# EAGLE design Qwiic_Quad_Relay (EAGLE 9.6.2)
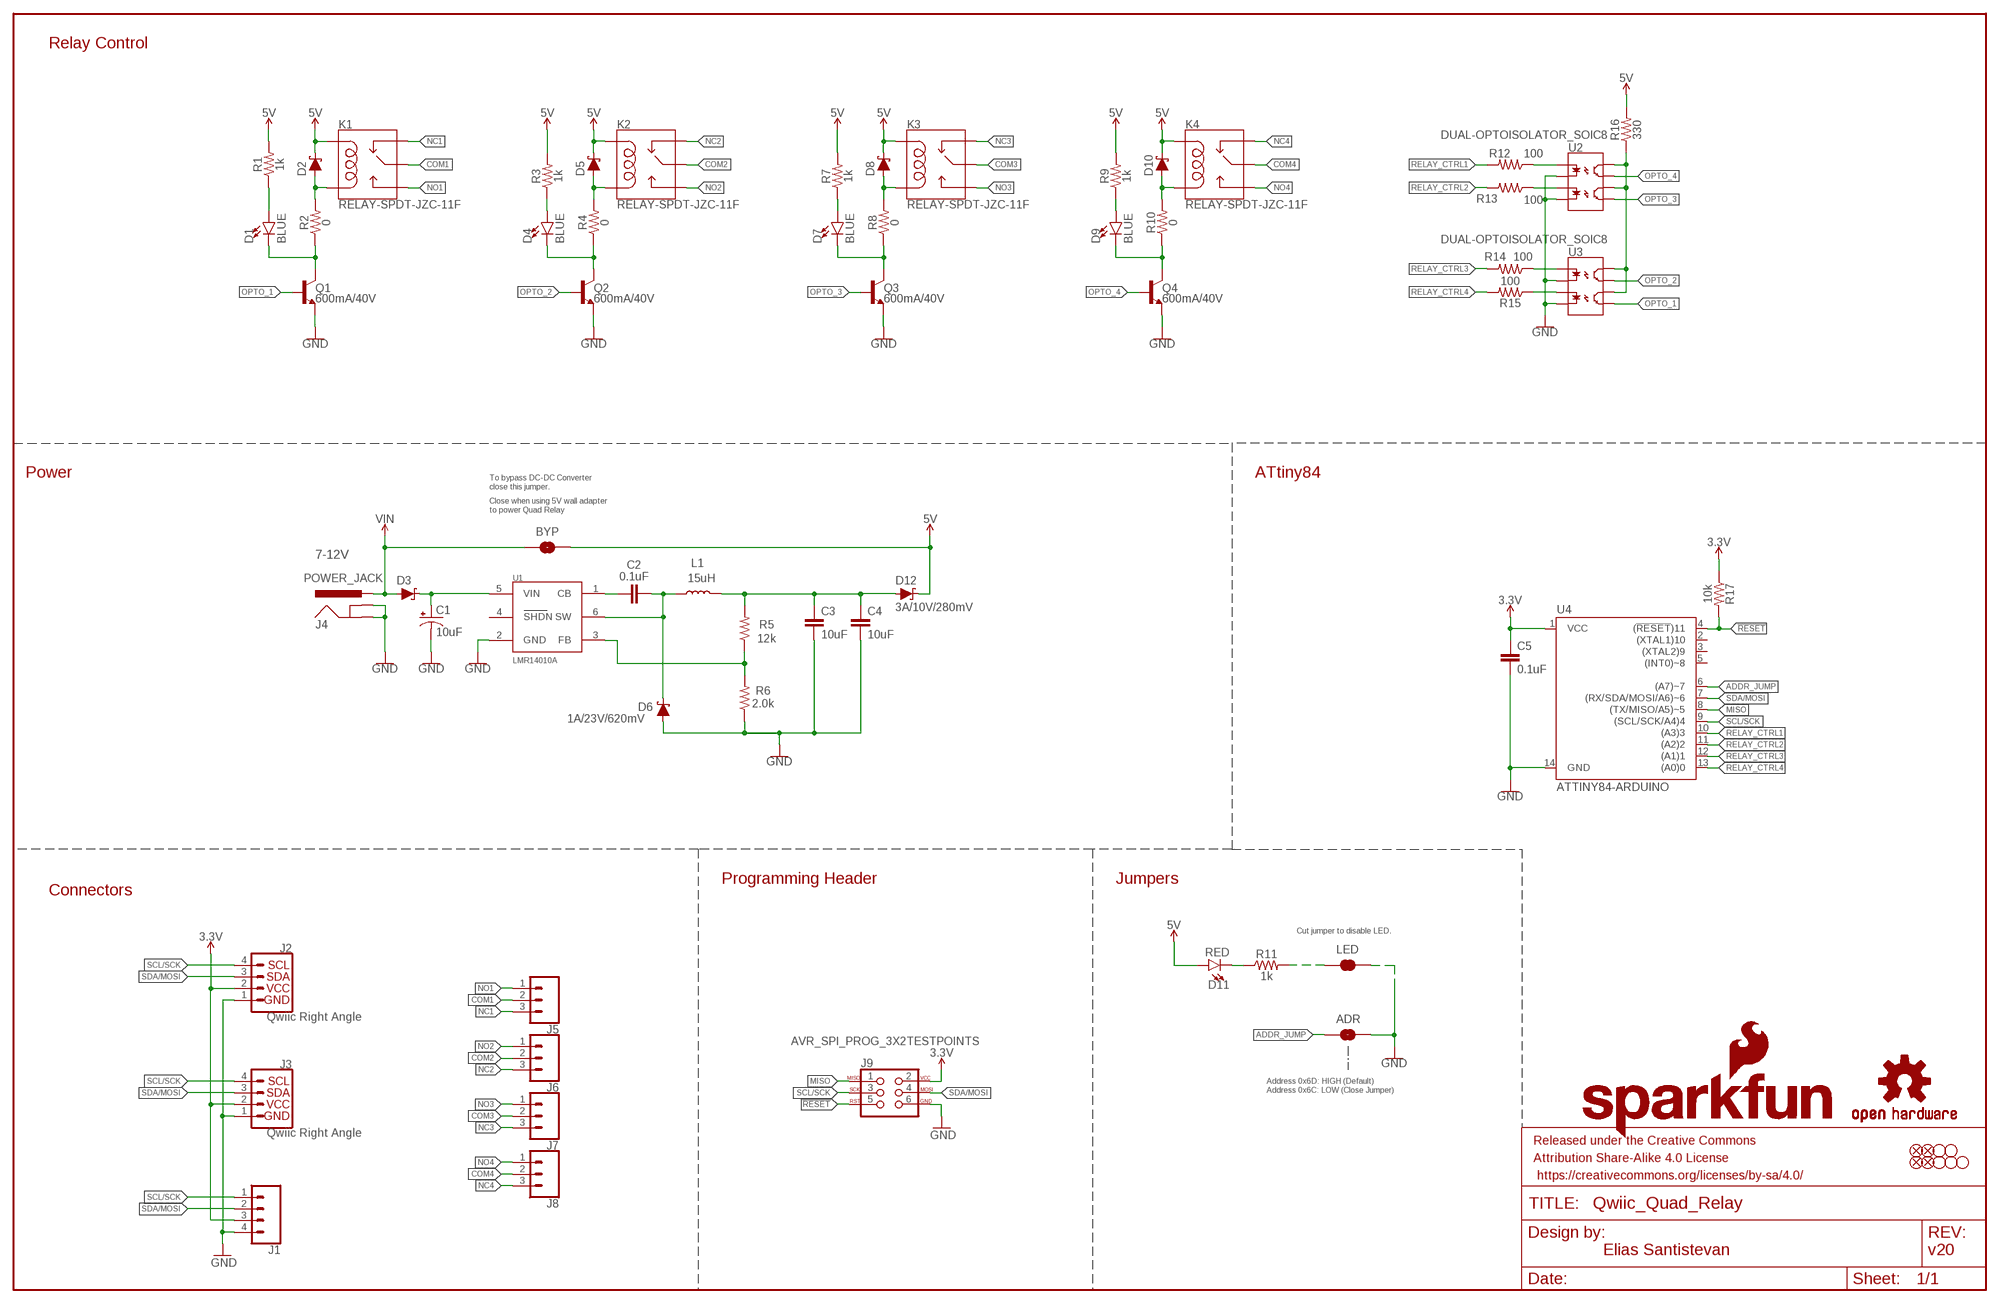
[diagram p0: schematic, sheet 1]

## Parts
ADR  JUMPER-SMT_2_NO_SILK  [SMT-JUMPER_2_NO_SILK]
BYP  JUMPER-SMT_2_NO_SILK  [SMT-JUMPER_2_NO_SILK]
C1  10uF  10UF-POLAR-EIA3528-20V-10%(TANT)  [EIA3528]
C2  0.1uF  0.1UF-0402-10V-10%-X7R  [0402]
C3  10uF  10UF-0603-6.3V-20%  [0603]
C4  10uF  10UF-0603-6.3V-20%  [0603]
C5  0.1uF  0.1UF-0603-25V-(+80/-20%)  [0603]
D1  BLUE  LED-BLUE0603  [LED-0603]
D2  1A/23V/620mV  DIODE-SCHOTTKY-BAT20J  [SOD-323]
D3  1A/40V/500mV  DIODE-SCHOTTKY-SS14  [SMA-DIODE]
D4  BLUE  LED-BLUE0603  [LED-0603]
D5  1A/23V/620mV  DIODE-SCHOTTKY-BAT20J  [SOD-323]
D6  1A/23V/620mV  DIODE-SCHOTTKY-BAT20J  [SOD-323]
D7  BLUE  LED-BLUE0603  [LED-0603]
D8  1A/23V/620mV  DIODE-SCHOTTKY-BAT20J  [SOD-323]
D9  BLUE  LED-BLUE0603  [LED-0603]
D10  1A/23V/620mV  DIODE-SCHOTTKY-BAT20J  [SOD-323]
D11  RED  LED-RED0603  [LED-0603]
D12  3A/10V/280mV  DIODE-SCHOTTKY-BAT60A  [SOD-323]
FD1  FIDUCIAL1X2  [FIDUCIAL-1X2]
FD2  FIDUCIAL1X2  [FIDUCIAL-1X2]
FD3  FIDUCIAL1X2  [FIDUCIAL-1X2]
FD4  FIDUCIAL1X2  [FIDUCIAL-1X2]
FRAME1  FRAME-LEDGER  [CREATIVE_COMMONS]
J1  CONN_041X04_NO_SILK_NO_POP  [1X04_NO_SILK]
J2  Qwiic Right Angle  I2C_STANDARDQWIIC  [JST04_1MM_RA]
J3  Qwiic Right Angle  I2C_STANDARDQWIIC  [JST04_1MM_RA]
J4  POWER_JACK  [POWER_JACK_PTH]
J5  CONN_03-SCREW-5MM  [SCREWTERMINAL-5MM-3]
J6  CONN_03-SCREW-5MM  [SCREWTERMINAL-5MM-3]
J7  CONN_03-SCREW-5MM  [SCREWTERMINAL-5MM-3]
J8  CONN_03-SCREW-5MM  [SCREWTERMINAL-5MM-3]
J9  AVR_SPI_PROG_3X2TESTPOINTS  [2X3_TEST_POINTS]
JP1  STAND-OFF  [STAND-OFF]
JP4  STAND-OFF  [STAND-OFF]
JP5  STAND-OFF  [STAND-OFF]
JP6  STAND-OFF  [STAND-OFF]
JP7  STAND-OFF  [STAND-OFF]
K1  RELAY-SPDT-JZC-11F  [RELAY-JZC]
K2  RELAY-SPDT-JZC-11F  [RELAY-JZC]
K3  RELAY-SPDT-JZC-11F  [RELAY-JZC]
K4  RELAY-SPDT-JZC-11F  [RELAY-JZC]
L1  15uH  INDUCTOR-LQH5B-15UH  [INDUCTOR_15UH]
LED  JUMPER-SMT_2_NC_TRACE_SILK  [SMT-JUMPER_2_NC_TRACE_SILK]
LOGO1  SFE_LOGO_NAME_FLAME.1_INCH  [SFE_LOGO_NAME_FLAME_.1]
LOGO2  OSHW-LOGOS  [OSHW-LOGO-S]
Q1  600mA/40V  TRANS_NPN-MMBT2222AL  [SOT23-3]
Q2  600mA/40V  TRANS_NPN-MMBT2222AL  [SOT23-3]
Q3  600mA/40V  TRANS_NPN-MMBT2222AL  [SOT23-3]
Q4  600mA/40V  TRANS_NPN-MMBT2222AL  [SOT23-3]
R1  1k  1KOHM-0603-1/10W-1%  [0603]
R2  0  0OHM-0603-1/10W  [0603]
R3  1k  1KOHM-0603-1/10W-1%  [0603]
R4  0  0OHM-0603-1/10W  [0603]
R5  12k  12KOHM-0603-1/10W-1%  [0603]
R6  2.0k  2.0KOHM-0603-1/10W-5%  [0603]
R7  1k  1KOHM-0603-1/10W-1%  [0603]
R8  0  0OHM-0603-1/10W  [0603]
R9  1k  1KOHM-0603-1/10W-1%  [0603]
R10  0  0OHM-0603-1/10W  [0603]
R11  1k  1KOHM-0603-1/10W-1%  [0603]
R12  100  100OHM-0603-1/10W-1%  [0603]
R13  100  100OHM-0603-1/10W-1%  [0603]
R14  100  100OHM-0603-1/10W-1%  [0603]
R15  100  100OHM-0603-1/10W-1%  [0603]
R16  330  330OHM-0603-1/10W-1%  [0603]
R17  10k  10KOHM-0603-1/10W-1%  [0603]
U1  LMR14010A  [SOT23-6]
U2  DUAL-OPTOISOLATOR_SOIC8  [SO08]
U3  DUAL-OPTOISOLATOR_SOIC8  [SO08]
U4  ATTINY84-ARDUINO  [SO14]

## Nets
3.3V: C5.1 J1.3 J2.2 J3.2 J9.2 R17.1 U4.1(VCC)
5V: BYP.2 D2.C D5.C D8.C D10.C D11.A D12.C K1.5(COIL1) K2.5(COIL1) K3.5(COIL1) K4.5(COIL1) R1.2 R3.2 R7.2 R9.2 R16.2
5V_OUT: C3.1 C4.1 D12.A L1.P2 R5.2
!RESET: J9.5 R17.2 U4.4((!RESET!)11)
ADDR_JUMP: ADR.1 U4.6((A7)~7)
CB: C2.1 U1.1(CB)
COM1: J5.2 K1.4(MAIN)
COM2: J6.2 K2.4(MAIN)
COM3: J7.2 K3.4(MAIN)
COM4: J8.2 K4.4(MAIN)
FB: R5.1 R6.2 U1.3(FB)
GND: ADR.2 C1.C(-) C3.2 C4.2 C5.2 D6.A J1.4 J2.1 J3.1 J4.GND J4.GNDBREAK J9.6 LED.1 Q1.2(E) Q2.2(E) Q3.2(E) Q4.2(E) R6.1 U1.2(GND) U2.2(C1) U2.4(C2) U3.2(C1) U3.4(C2) U4.14(GND)
MISO: J9.1 U4.8((TX/MISO/A5)~5)
N$1: D1.A R1.1
N$2: D1.C Q1.3(C) R2.1
N$3: R15.1 U3.3(A2)
N$4: D4.A R3.1
N$5: R14.1 U3.1(A1)
N$6: R16.1 U2.6(CL2) U2.8(CL1) U3.6(CL2) U3.8(CL1)
N$7: D7.A R7.1
N$8: D9.A R9.1
N$9: R12.1 U2.1(A1)
N$10: D2.A K1.1(COIL2) R2.2
N$11: R13.1 U2.3(A2)
N$12: D4.C Q2.3(C) R4.1
N$13: D11.C R11.1
N$14: LED.2 R11.2
N$15: D7.C Q3.3(C) R8.1
N$17: D9.C Q4.3(C) R10.1
N$18: D5.A K2.1(COIL2) R4.2
N$23: D8.A K3.1(COIL2) R8.2
N$24: D10.A K4.1(COIL2) R10.2
NC1: J5.3 K1.2(NC)
NC2: J6.3 K2.2(NC)
NC3: J7.3 K3.2(NC)
NC4: J8.3 K4.2(NC)
NO1: J5.1 K1.3(NO)
NO2: J6.1 K2.3(NO)
NO3: J7.1 K3.3(NO)
NO4: J8.1 K4.3(NO)
OPTO_1: Q1.1(B) U3.5(EM2)
OPTO_2: Q2.1(B) U3.7(EM1)
OPTO_3: Q3.1(B) U2.5(EM2)
OPTO_4: Q4.1(B) U2.7(EM1)
RELAY_CTRL1: R12.2 U4.10((A3)3)
RELAY_CTRL2: R13.2 U4.11((A2)2)
RELAY_CTRL3: R14.2 U4.12((A1)1)
RELAY_CTRL4: R15.2 U4.13((A0)0)
SCL/SCK: J1.1 J2.4 J3.4 J9.3 U4.9((SCL/SCK/A4)4)
SDA/MOSI: J1.2 J2.3 J3.3 J9.4 U4.7((RX/SDA/MOSI/A6)~6)
SW: C2.2 D6.C L1.P1 U1.6(SW)
VIN: BYP.1 D3.A J4.PWR
VIN_DC_DC: C1.A(+) D3.C U1.5(VIN)
Unconnected: U1.4(SHDN) U4.2((XTAL1)10) U4.3((XTAL2)9) U4.5((INT0)~8)

## Notes on the sheet
- Relay Control
- Power | ATtiny84
- To bypass DC-DC Converter
  close this jumper.
- Close when using 5V wall adapter
  to power Quad Relay
- 7-12V
- Programming Header | Jumpers
- Connectors
- Cut jumper to disable LED.
- Address 0x6D: HIGH (Default)
  Address 0x6C: LOW (Close Jumper)
- Elias Santistevan | v20

## Library data of the parts
ADR BYP = SparkFun-Jumpers:JUMPER-SMT_2_NO: Normally open jumper This jumper has two pads in close proximity to each other. Apply solder to close the connection. Round pads are easier to solder for beginners, but are a lot larger. SparkFun Product that uses the round pads: SparkFun EL Sequencer <https://www.sparkfun.com/products/12781>
C1 = SparkFun-Capacitors:10UF-POLAR: 10.0µF polarized capacitors A capacitor is a passive two-terminal electrical component used to store electrical energy temporarily in an electric field.; PROD_ID: CAP-08063
C2 = SparkFun-Capacitors:0.1UF: 0.1µF ceramic capacitors A capacitor is a passive two-terminal electrical component used to store electrical energy temporarily in an electric field.; PROD_ID: CAP-15083
C3 C4 = SparkFun-Capacitors:10UF: 10.0µF ceramic capacitors A capacitor is a passive two-terminal electrical component used to store electrical energy temporarily in an electric field.; PROD_ID: CAP-11015
C5 = SparkFun-Capacitors:0.1UF: 0.1µF ceramic capacitors A capacitor is a passive two-terminal electrical component used to store electrical energy temporarily in an electric field.; PROD_ID: CAP-00810
D1 D4 D7 D9 = SparkFun-LED:LED-BLUE: Blue SMD LED Used in manufacturing of various products at SparkFun Packages: 0603 - SMD 0603 package [Product Link] <http://www.digikey.com/product-detail/en/SMLE12BC7TT86/511-1589-2-ND/1641808> 1206 - SMD1206 package [Product Link] <http://www.digikey.com/product-detail/en/lite-on-inc/LTST-C150TBKT/160-1643-1-ND/573584> SparkFun Products: ESP8266 Thing-Dev Board <https://www.sparkfun.com/products/13711> RedBoard <https://www.sparkfun.com/products/12757>; PROD_ID: DIO-08575
D2 D5 D6 D8 D10 = SparkFun-DiscreteSemi:DIODE-SCHOTTKY: Schottky diode A Schottky diode is a semiconductor diode which has a low forward voltage drop and a very fast switching action.; PROD_ID: DIO-11623
D3 = SparkFun-DiscreteSemi:DIODE-SCHOTTKY: Schottky diode A Schottky diode is a semiconductor diode which has a low forward voltage drop and a very fast switching action.; PROD_ID: DIO-08053
D11 = SparkFun-LED:LED-RED: Red SMD LED Used in manufacturing of most products at SparkFun Packages: 0603 - SMD 0603 package [Product Link] <http://docs.avagotech.com/docs/AV02-0551EN> 0603 SMART - SMD 0603 SMART package ( more efficient and expensive)[Product Link] <http://www.osram-os.com/Graphics/XPic2/00077099_0.pdf> 1206 - SMD1206 package [Product Link] <https://www.sparkfun.com/datasheets/DevTools/LilyPad/Q150OVS4.pdff> SparkFun Products: Pro Mini 328 -5V <https://www.sparkfun.com/products/821> RedBoard <https://www.sparkfun.com/products/12757> IOIO-OTG <https://www.sparkfun.com/products/13613>; PROD_ID: DIO-00819
D12 = SparkFun-DiscreteSemi:DIODE-SCHOTTKY: Schottky diode A Schottky diode is a semiconductor diode which has a low forward voltage drop and a very fast switching action.; PROD_ID: DIO-14072
FD1-FD4 = SparkFun-Aesthetics:FIDUCIAL: Fiducial Alignment Points Point-of-reference for pick-and-place machines and other optical instruments.
FRAME1 = SparkFun-Aesthetics:FRAME-LEDGER: Schematic Frame - Ledger Standard 11x14 US Ledger frame
J1 = SparkFun-Connectors:CONN_04: Multi connection point. Often used as Generic Header-pin footprint for 0.1 inch spaced/style header connections On any of the 0.1 inch spaced packages, you can populate with these: Break Away Headers - Straight <https://www.sparkfun.com/products/116> (PRT-00116) Break Away Male Headers - Right Angle <https://www.sparkfun.com/products/553> (PRT-00553) Female Headers <https://www.sparkfun.com/products/115> (PRT-00115) Break Away Headers - Machine Pin <https://www.sparkfun.com/products/117> (PRT-00117) Break Away Female Headers - Swiss Machine Pin <https://www.sparkfun.com/products/743> (PRT-00743) For SCREWTERMINALS and SPRING TERMINALS visit here: Screw Terimnals on SparkFun.com <https://www.sparkfun.com/search/results?term=Screw+Terminals> (5mm/3.5mm/2.54mm spacing) This device is also useful as a general connection point to wire up your design to another part of your project. Our various solder wires solder well into these plated through hole pads. Hook-Up Wire - Assortment (Stranded, 22 AWG) <https://www.sparkfun.com/products/11375> (PRT-11375) Hook-Up Wire - Assortment (Solid Core, 22 AWG) <https://www.sparkfun.com/products/11367> (PRT-11367) View the entire wire category on our website here <https://www.sparkfun.com/categories/141> Special notes: Molex polarized connector foot print use with SKU : PRT-08231 with associated crimp pins and housings. 1MM SMD Version SKU: PRT-10208
J2 J3 = SparkFun-Connectors:I2C_STANDARD: SparkFun I2C Standard Pinout Header SparkFun has standardized on a pinout for all I2C based sensor breakouts. This pinout allows I2C boards to be plugged directly into the headers on Arduino Uno compatible boards, and to be daisy chained easily. Example SparkFun Products: SparkFun Atmospheric Sensor Breakout - BME280 <https://www.sparkfun.com/products/13676> SparkFun Altitude/Pressure Sensor Breakout - MPL3115A2 <https://www.sparkfun.com/products/11084> SparkFun TOF Range Finder Sensor - VL6180 <https://www.sparkfun.com/products/12785>; PROD_ID: CONN-13694
J4 = SparkFun-Connectors:POWER_JACK: Power Jack Connector This is the standard 5.5mm barrel jack for power. The PTH is the most common, proven, reliable, footprint. The Slot footprint only works if the mill layer is transmitted to the PCB fab house so be warned. Here are the connectors we sell at SparkFun: DC Barrel Power Jack/Connector <https://www.sparkfun.com/products/119> (PRT-00119) DC Barrel Power Jack/Connector (SMD) <https://www.sparkfun.com/products/12748> (PRT-12748) DC Barrel Jack Adapter - Breadboard Compatible <https://www.sparkfun.com/products/10811> (PRT-10811) It is used on this SparkFun product (and many, many others): SparkFun RedBoard - Programmed with Arduino <https://www.sparkfun.com/products/12757> (DEV-12757) Also, if you need a mating power supply or connector, please check these out: Wall Adapter Power Supply - 9VDC 650mA <https://www.sparkfun.com/products/298> (TOL-00298) DC Barrel Jack Adapter - Male <https://www.sparkfun.com/products/10287> (PRT-10287); PROD_ID: CONN-08197
J5-J8 = SparkFun-Connectors:CONN_03: Multi connection point. Often used as Generic Header-pin footprint for 0.1 inch spaced/style header connections On any of the 0.1 inch spaced packages, you can populate with these: Break Away Headers - Straight <https://www.sparkfun.com/products/116> (PRT-00116) Break Away Male Headers - Right Angle <https://www.sparkfun.com/products/553> (PRT-00553) Female Headers <https://www.sparkfun.com/products/115> (PRT-00115) Break Away Headers - Machine Pin <https://www.sparkfun.com/products/117> (PRT-00117) Break Away Female Headers - Swiss Machine Pin <https://www.sparkfun.com/products/743> (PRT-00743) Stackable Header - 3 Pin (Female, 0.1") <https://www.sparkfun.com/products/13875> (PRT-13875) For SCREWTERMINALS and SPRING TERMINALS visit here: Screw Terimnals on SparkFun.com <https://www.sparkfun.com/search/results?term=Screw+Terminals> (5mm/3.5mm/2.54mm spacing) This device is also useful as a general connection point to wire up your design to another part of your project. Our various solder wires solder well into these plated through hole pads. Hook-Up Wire - Assortment (Stranded, 22 AWG) <https://www.sparkfun.com/products/11375> (PRT-11375) Hook-Up Wire - Assortment (Solid Core, 22 AWG) <https://www.sparkfun.com/products/11367> (PRT-11367) View the entire wire category on our website here <https://www.sparkfun.com/categories/141> Special notes: Molex polarized connector foot print use with SKU : PRT-08232 with associated crimp pins and housings.; PROD_ID: CONN-10134; SF_SKU: PRT-08433
J9 = SparkFun-Connectors:AVR_SPI_PROG_3X2: AVR ISP 6 Pin This is the reduced ISP connector for AVR programming. Common on Arduino. This footprint will take up less PCB space and can be used with a 10-pin to 6-pin adapter such as SKU: BOB-08508 **Special note about "TEST_POINT" package. The stop mask is on the top side, so if you want your programming test points to be on the bottom of your board, make sure to place this package on the bottom side of the board. This also ensure that the orientation to program from the bottom side will be correct. SparkFun Products: SparkFun ISP Pogo Adapter <https://www.sparkfun.com/products/11591> - NS Tiny AVR Programmer <https://www.sparkfun.com/products/11801> -PTH
JP1 JP4-JP7 = SparkFun-Hardware:STAND-OFF: Stand Off Drill holes for mechanically mounting via screws, standoffs, etc. Note: Use the keepout ring to avoid running the screw head into surrounding components. Variant Overviews STAND-OFF - Mechanical footprint for a #4 phillips button head screw. STAND-OFF-TIGHT - Mechanical footprint for a #4 phillips button head screw, Example SparkFun Products Screw - Phillips Head (1/4", 4-40, 10 pack) <https://www.sparkfun.com/products/10453> (PRT-10453) Screw - Phillips Head (1/2", 4-40, 10 pack) <https://www.sparkfun.com/products/10452> (PRT-10452) Screw - Phillips Head (3/4", 4-40, 10 pack) <https://www.sparkfun.com/products/10451> (PRT-10451) Screw - Phillips Head (1", 4-40, 10 pack) <https://www.sparkfun.com/products/10450> (PRT-10450)
K1-K4 = SparkFun-Electromechanical:RELAY-SPDT: SPDT Electromechanical Relay Single-pole, double-throw sealed relays. When current is applied to the coil, it throws a simple changeover switch, terminating the connection from the NC contact to ground and closing the NO contact. Use them to switch high voltage/high current devices. SparkFun Products JQX-15F: Relay SPDT Sealed - 20A <https://www.sparkfun.com/products/10924> (COM-10924) JZC-11F: Relay SPDT Sealed <https://www.sparkfun.com/products/100> (COM-00100); PROD_ID: COMP-09533; SF_SKU: COM-00100
L1 = SparkFun-Coils:INDUCTOR: Inductors Resist changes in electrical current. Basically a coil of wire. SparkFun Products: SparkFun Load Cell Amplifier - HX711 <https://www.sparkfun.com/products/13879> IOIO-OTG - V2.2 <https://www.sparkfun.com/products/13613>; PROD_ID: NDUC-15090
LED = SparkFun-Jumpers:JUMPER-SMT_2_NC_TRACE: Normally closed trace jumper This jumper has a trace between two pads so it's normally closed (NC). Use a razor knife to open the connection. For best results follow the IPC guidelines for cutting traces: Cutout at least 0.063 mm (0.005 in). Remove all loose material to clean up the cut area. Seal the cut with an approved epoxy. Reapply solder to reclose the connection.
LOGO1 = SparkFun-Aesthetics:SFE_LOGO_NAME_FLAME: SparkFun Font Logo w/ Flame This is the SparkFun full logo. The logo on the schematic will always be the same size; the package variant is the height of the flame part of the logo. Default layer for the logo on the board is tSilk.
LOGO2 = SparkFun-Aesthetics:OSHW-LOGO: Open-Source Hardware (OSHW) Logo This logo indicates the piece of hardware it is found on incorporates a OSHW license and/or adheres to the definition of open source hardware found here: http://freedomdefined.org/OSHW
Q1-Q4 = SparkFun-DiscreteSemi:TRANS_NPN: NPN transistor Current controlled devices typically used to amplify current or used as a switch. BC547 - COM-08928 <http://www.sparkfun.com/products/8928> (TO-92 45V 100mA) (1.Collector 2.Base 3.Emitter) 2N3904 - COM-00521 <http://www.sparkfun.com/products/521> (TO-92 40V 200mA) (1.Emitter 2.Base 3.Collector) P2N2222A - COM-12852 <http://www.sparkfun.com/products/12852> (TO-92 40V 600mA) (1.Collector 2.Base 3.Emitter); PROD_ID: TRANS-08049
R1 R3 R7 R9 R11 = SparkFun-Resistors:1KOHM: 1kΩ resistor A resistor is a passive two-terminal electrical component that implements electrical resistance as a circuit element. Resistors act to reduce current flow, and, at the same time, act to lower voltage levels within circuits. - Wikipedia; PROD_ID: RES-07856
R2 R4 R8 R10 = SparkFun-Resistors:0OHM: 0Ω resistor A resistor is a passive two-terminal electrical component that implements electrical resistance as a circuit element. Resistors act to reduce current flow, and, at the same time, act to lower voltage levels within circuits. - Wikipedia; PROD_ID: RES-08609
R5 = SparkFun-Resistors:12KOHM: 12kΩ resistor A resistor is a passive two-terminal electrical component that implements electrical resistance as a circuit element. Resistors act to reduce current flow, and, at the same time, act to lower voltage levels within circuits. - Wikipedia; PROD_ID: RES-10327
R6 = SparkFun-Resistors:2.0KOHM: 2kΩ resistor A resistor is a passive two-terminal electrical component that implements electrical resistance as a circuit element. Resistors act to reduce current flow, and, at the same time, act to lower voltage levels within circuits. - Wikipedia; PROD_ID: RES-08296
R12-R15 = SparkFun-Resistors:100OHM: 100Ω resistor A resistor is a passive two-terminal electrical component that implements electrical resistance as a circuit element. Resistors act to reduce current flow, and, at the same time, act to lower voltage levels within circuits. - Wikipedia; PROD_ID: RES-07863
R16 = SparkFun-Resistors:330OHM: 330Ω resistor A resistor is a passive two-terminal electrical component that implements electrical resistance as a circuit element. Resistors act to reduce current flow, and, at the same time, act to lower voltage levels within circuits. - Wikipedia; PROD_ID: RES-00818
R17 = SparkFun-Resistors:10KOHM: 10kΩ resistor A resistor is a passive two-terminal electrical component that implements electrical resistance as a circuit element. Resistors act to reduce current flow, and, at the same time, act to lower voltage levels within circuits. - Wikipedia; PROD_ID: RES-00824
U1 = SparkFun-IC-Power:LMR14010A: LMR14010A Buck Regulator 1A Output The LMR14010A is a PWM DC-to-DC buck (stepdown) regulator. With a wide input range from 4 V to 40 V, it is suitable for a wide range of applications from industrial to automotive. An ultra-low 1-µA shutdown current prolongs battery life. Operating frequency is fixed at 0.7 MHz, allowing the use of small external components while minimizing output ripple voltage. Soft-start and compensation circuits are implemented internally, limiting the number of external components. The LMR14010A is optimized for up to 1-A load current. It has a 0.765-V nominal feedback voltage; PROD_ID: IC-15089
U2 U3 = SparkFun-DiscreteSemi:DUAL-OPTOISOLATOR: Optocoupler, Phototransistor Output, Dual Channel Optically coupled pairs with a gallium arsenide infrared LED and a silicon NPN phototransistor. Signal information, including a DC level, can be transmitted by the device while maintaining a high degree of electrical isolation between input and output. Datasheet <https://www.sparkfun.com/datasheets/Components/SMD/ild205t.pdf> SparkFun Products: SparkFun Opto-isolator Breakout <https://www.sparkfun.com/products/9118>; PROD_ID: IC-09076
U4 = SparkFun-IC-Microcontroller:ATTINY84-ARDUINO; PROD_ID: IC-14155

## Board
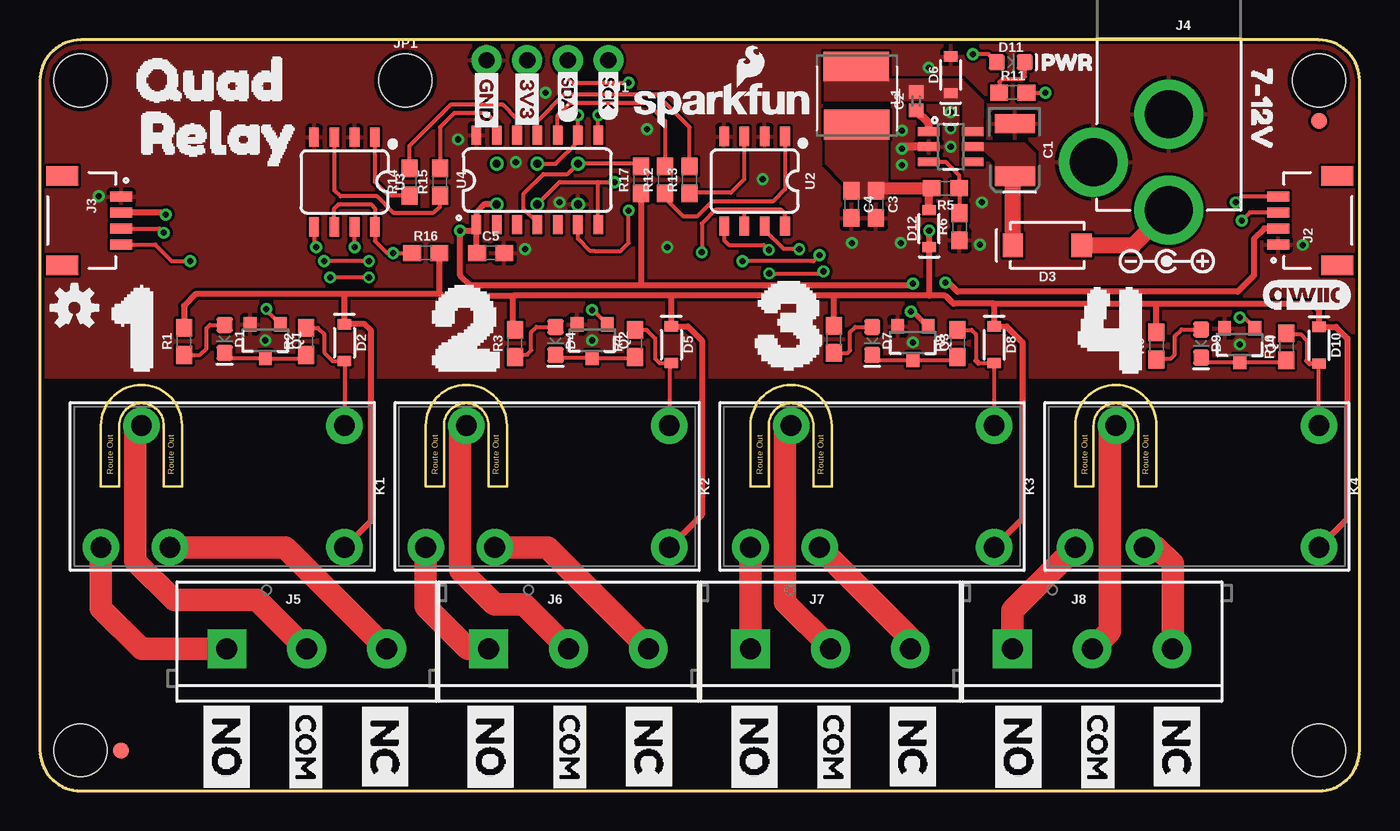
[diagram p1: board, top side]
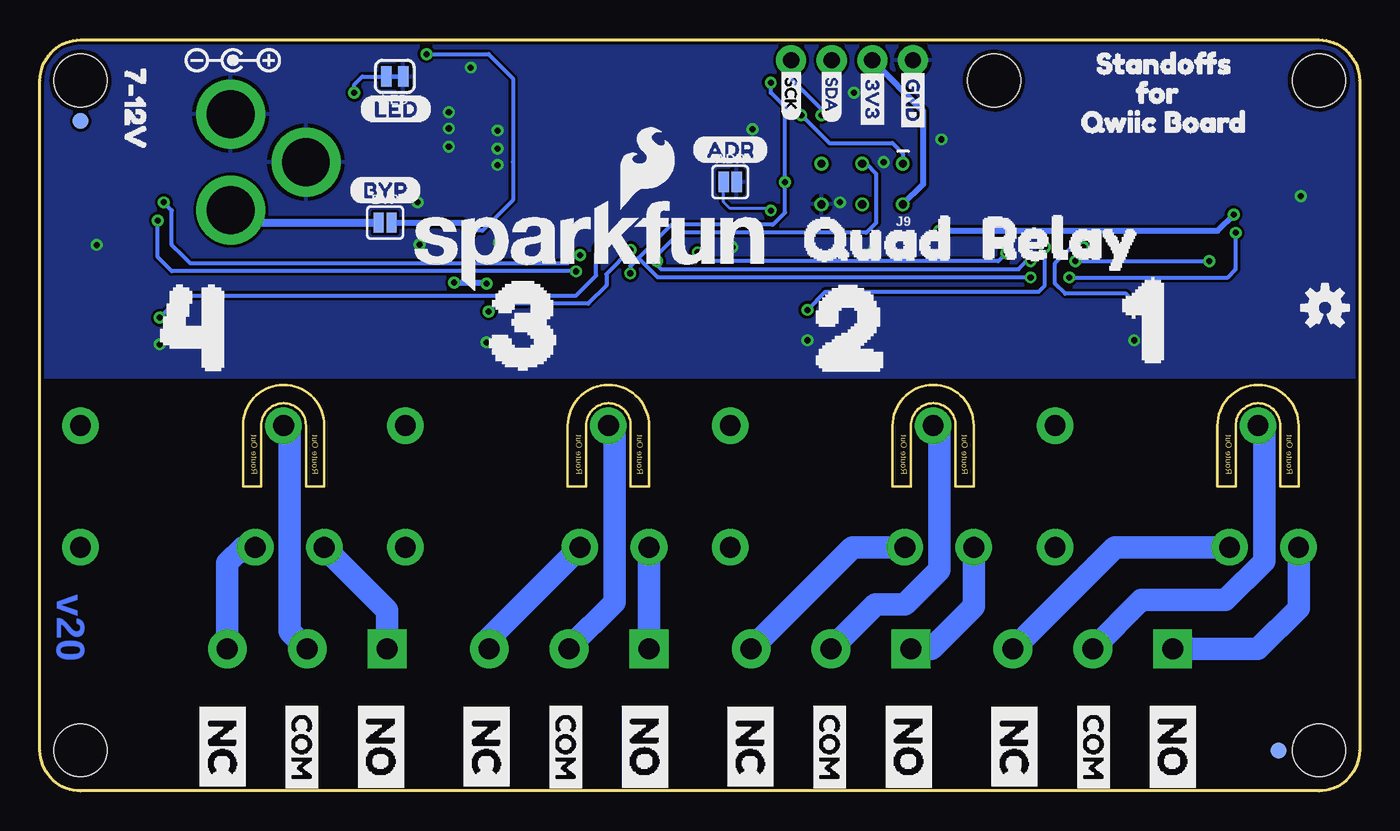
[diagram p2: board, bottom side, seen from below]

Size 82.55 x 46.99 mm. Coordinates in mm from the lower left corner, seen from the top.
Outline: 80.01,46.99 2.54,46.99 arc90 0,44.45 0,2.54 arc90 2.54,0 80.01,0 arc90 82.55,2.54 82.55,44.45 arc90 80.01,46.99
Outline: 28.07,19.05 28.07,22.86 arc90 26.67,24.26 arc90 25.27,22.86 25.27,19.05 24.13,19.05 24.13,22.86 arc-90 26.67,25.4 arc-90 29.21,22.86 29.21,19.05 28.07,19.05
Outline: 7.75,19.05 7.75,22.86 arc90 6.35,24.26 arc90 4.95,22.86 4.95,19.05 3.81,19.05 3.81,22.86 arc-90 6.35,25.4 arc-90 8.89,22.86 8.89,19.05 7.75,19.05
Outline: 48.39,19.05 48.39,22.86 arc90 46.99,24.26 arc90 45.59,22.86 45.59,19.05 44.45,19.05 44.45,22.86 arc-90 46.99,25.4 arc-90 49.53,22.86 49.53,19.05 48.39,19.05
Outline: 68.71,19.05 68.71,22.86 arc90 67.31,24.26 arc90 65.91,22.86 65.91,19.05 64.77,19.05 64.77,22.86 arc-90 67.31,25.4 arc-90 69.85,22.86 69.85,19.05 68.71,19.05
Copper layers (1*16): Top 0.035mm / dielectric 1.5mm / Bottom 0.035mm
Design rules "SparkFun-2-layer-TIGHT": minimum track width 7mil, minimum drill 15mil, track to track 7mil, track to pad 7mil, pad to pad 7mil, via to via 7mil, smd to smd 7mil, copper to edge 7mil, drill to drill 7mil, minimum pad ring 7mil, minimum via ring 7mil, stop-mask expansion 4mil, vias tented up to drill 25mil, thermal gap 10mil

### Footprints (pad centres in the part's own frame; a part is rotated, then mirrored left to right if it is on the bottom)
SMT-JUMPER_2_NO_SILK = smd 0.635 x 1.27: 1 -0.406,0; 2 0.406,0
EIA3528 = smd 1.2 x 2.5: A 1.65,0; C -1.65,0
0402 = smd 0.85 x 0.9: 1 -0.58,0; 2 0.58,0
0603 = smd 1.1 x 1: 1 -0.85,0; 2 0.85,0
LED-0603 = smd 1 x 1: A -0.877,0; C 0.877,0
SOD-323 = smd 0.63 x 0.83: A 1.15,0; C -1.15,0
SMA-DIODE = smd 1.27 x 1.47: A -2.15,0; C 2.15,0
FIDUCIAL-1X2 = smd 1 x 1: 1 0,0
1X04_NO_SILK = drill 1.016 pad 1.88: 1 0,0; 2 2.54,0; 3 5.08,0; 4 7.62,0
JST04_1MM_RA = smd 0.6 x 1.35: 1 -1.5,0; 2 -0.5,0; 3 0.5,0; 4 1.5,0 | smd 1.2 x 2: NC1 2.8,-3.675; NC2 -2.8,-3.675
POWER_JACK_PTH = drill 2.997 pad 4.318: GND 0,7.7; GNDBREAK 4.7,10.7; PWR 0,13.7
SCREWTERMINAL-5MM-3 = drill 1.3 pad 2.413 square: 1 0,0 | drill 1.3 pad 2.413: 2 5,0; 3 10,0
2X3_TEST_POINTS = drill 0.508: 1 -2.54,-1.27; 2 -2.54,1.27; 3 0,-1.27; 4 0,1.27; 5 2.54,-1.27; 6 2.54,1.27
STAND-OFF = hole 3.302: 0,0
RELAY-JZC = drill 1.3 pad 2.286: 1 3.81,-8.89; 2 -3.81,2.032; 3 -3.81,6.35; 4 3.81,3.81; 5 -3.81,-8.89
INDUCTOR_15UH = smd 1.85 x 4.1: P1 -1.905,0; P2 1.745,0.05
SMT-JUMPER_2_NC_TRACE_SILK = smd 0.66 x 1.27: 1 -0.521,0; 2 0.521,0
SOT23-3 = smd 0.8 x 0.9: 1 -0.95,-1; 2 0.95,-1; 3 0,1.1
SOT23-6 = smd 0.55 x 1.35: 1 -0.95,-1.375; 2 0,-1.375; 3 0.95,-1.375; 4 0.95,1.375; 5 0,1.375; 6 -0.95,1.375
SO08 = smd 0.6 x 1.2: 1 -1.905,-2.8; 2 -0.635,-2.8; 3 0.635,-2.8; 4 1.905,-2.8; 5 1.905,2.8; 6 0.635,2.8; 7 -0.635,2.8; 8 -1.905,2.8
SO14 = smd 0.6 x 1.2: 1 -3.81,-2.8; 2 -2.54,-2.8; 3 -1.27,-2.8; 4 0,-2.8; 5 1.27,-2.8; 6 2.54,-2.8; 7 3.81,-2.8; 8 3.81,2.8; 9 2.54,2.8; 10 1.27,2.8; 11 0,2.8; 12 -1.27,2.8; 13 -2.54,2.8; 14 -3.81,2.8

### Placement (x,y rotation side)
ADR  39.37,38.1 0 bottom
BYP  60.96,35.56 0 bottom
C1  60.99,40.11 270 top
C2  54.81,43.15 90 top
C3  52.3,36.7 270 top
C4  50.77,36.7 270 top
C5  28.19,33.66 0 top
D1  11.56,28.28 270 top
D2  19.05,28.05 270 top
D3  63.02,34.14 180 top
D4  32.26,28.16 270 top
D5  39.5,27.92 270 top
D6  56.97,44.81 90 top
D7  52.07,28.16 270 top
D8  59.69,27.92 270 top
D9  72.64,28 270 top
D10  80.01,27.89 270 top
D11  60.73,45.59 0 top
D12  55.63,35.18 90 top
FD1  80.01,41.91 0 bottom
FD2  5.08,2.54 0 top
FD3  5.08,2.54 0 bottom
FD4  80.01,41.91 0 top
FRAME1  7.62,-12.7 0 top  (outside the outline)
J1  35.56,45.72 180 top
J2  77.47,35.69 90 top
J3  5.08,35.69 270 top
J4  70.61,50.04 180 top
J5  11.68,8.89 0 top
J6  28.07,8.89 0 top
J7  44.45,8.89 0 top
J8  60.83,8.89 0 top
J9  31.11,37.97 180 bottom
JP1  22.86,44.45 0 top
JP4  2.54,44.45 0 top
JP5  80.01,44.45 0 top
JP6  2.54,2.54 0 top
JP7  80.01,2.54 0 top
K1  10.16,19.05 90 top
K2  30.48,19.05 90 top
K3  50.8,19.05 90 top
K4  71.12,19.05 90 top
L1  51.05,43.43 270 top
LED  60.35,44.7 180 bottom
LOGO1  42.72,42.93 0 top
LOGO2  2.16,30.23 0 top
Q1  14.1,28.19 180 top
Q2  34.54,28.19 180 top
Q3  54.61,28.07 180 top
Q4  75.06,27.94 180 top
R1  9.02,28.13 90 top
R2  16.64,28.13 90 top
R3  29.72,28 90 top
R4  37.21,28 90 top
R5  56.64,37.72 180 top
R6  57.53,35.31 90 top
R7  49.66,28.25 90 top
R8  57.4,28 90 top
R9  69.85,27.84 90 top
R10  77.98,27.78 90 top
R11  60.86,43.69 0 top
R12  39.12,38.23 90 top
R13  40.64,38.23 90 top
R14  23.11,38.1 90 top
R15  25.02,38.1 90 top
R16  24.13,33.66 0 top
R17  37.59,38.23 90 top
U1  56.97,40.31 270 top
U2  44.7,38.15 180 top
U3  19.05,38.1 180 top
U4  31.11,38.23 0 top
U$1  [7#12V0]  76.45,46.35 270 top
U$2  [20]  19.94,28.96 0 top
U$3  [10]  -0.13,28.96 0 top
U$4  [30]  40.13,29.21 0 top
U$5  [40]  60.33,28.83 0 top
U$6  [QUAD0]  3.66,44.5 0 top
U$7  [RELAY0]  4.04,41.15 0 top
U$8  [SCK-[)-03]  35.56,45.34 270 top
U$9  [GND-03]  27.94,45.34 270 top
U$10  [3V3-03]  30.48,45.34 270 top
U$11  [SDA0]  33.02,45.34 270 top
U$12  [3V3-03]  30.48,45.34 270 bottom
U$13  [OSHW-LOGO-S]  2.16,30.23 0 bottom
U$14  [BYP]  63.25,37.59 0 bottom
U$15  [NO0]  11.68,6.22 270 top
U$16  [COM0]  16.64,5.97 270 top
U$17  [NC0]  21.59,6.1 270 top
U$18  [NO0]  28.19,6.22 270 top
U$19  [COM0]  33.15,5.97 270 top
U$20  [NC0]  38.1,6.1 270 top
U$21  [NO0]  44.7,6.22 270 top
U$22  [COM0]  49.66,5.97 270 top
U$23  [NC0]  54.61,6.1 270 top
U$24  [NO0]  61.21,6.22 270 top
U$25  [COM0]  66.17,5.97 270 top
U$26  [NC0]  71.12,6.1 270 top
U$27  [NO0]  44.7,6.22 270 bottom
U$28  [COM0]  66.17,5.97 270 bottom
U$29  [NC0]  71.12,6.1 270 bottom
U$30  [NO0]  61.21,6.22 270 bottom
U$31  [COM0]  49.66,5.97 270 bottom
U$32  [NC0]  54.61,6.1 270 bottom
U$33  [NO0]  28.19,6.22 270 bottom
U$34  [COM0]  33.15,5.97 270 bottom
U$35  [NC0]  38.1,6.1 270 bottom
U$36  [NO0]  11.68,6.22 270 bottom
U$37  [COM0]  16.64,5.97 270 bottom
U$38  [NC0]  21.59,6.1 270 bottom
U$39  [10]  19.43,29.46 0 bottom
U$40  [20]  38.61,28.96 0 bottom
U$41  [30]  59.05,29.21 0 bottom
U$42  [40]  79.63,28.99 0 bottom
U$43  [QUAD0]  37.13,34.54 0 bottom
U$44  [RELAY0]  25.86,34.59 0 bottom
U$45  [GND-03]  27.94,45.34 270 bottom
U$46  [PWR_TO]  61.72,45.59 0 top
U$47  [SDA0]  33.02,45.34 270 bottom
U$48  [SCK-[)-03]  35.56,45.34 270 bottom
U$49  [7#12V0]  76.58,46.35 270 bottom
U$50  [STANDOFFS0]  17.63,45.52 0 bottom
U$51  [POLARITY_MARKING_CENTER_POSITIVE#JPG]  70.48,33.15 0 top
U$52  [FOR1]  15.14,43.69 0 bottom
U$53  [LED]  62.59,42.67 0 bottom
U$54  [POLARITY_MARKING_CENTER_POSITIVE#JPG]  70.48,45.72 0 bottom
U$55  [QWIIC_5.5MM]  79.25,31.04 0 top
U$56  [ADR-()-04]  41.78,40.13 0 bottom
U$57  [SFE_LOGO_NAME_FLAME_.2]  48.11,34.14 0 bottom
U$58  [QWIIC_BOARD2]  18.54,41.86 0 bottom

### Tracks (layer width: path | path; a pad name or v marks a point on that pad's centre or on a via)
3.3V  (via drill 0.38)
  Top 0.381: J2.2 76.59,35.19 75.95,34.54 75.95,32.26 74.93,31.24 57.4,31.24 56.84,31.8 v56.64,31.8 | v54.61,31.75 54.48,31.62 37.59,31.62 | R17.1 37.59,31.62 | 37.59,31.62 26.92,31.62 26.29,32.26 v26.29,35.05 27.3,35.05 | J9.2 27.81,36.7 27.3,36.2 U4.1 27.3,35.05 | C5.1 27.3,33.69 27.3,35.05 | v7.87,36.07 7.75,36.19 J3.2
  Bottom 0.381: v7.87,36.07 8.89,35.05 v26.29,35.05 | J9.2 28.55,36.7 27.3,37.95 27.3,42.55 J1.3 | v56.64,31.8 54.66,31.8 v54.61,31.75
5V  (via drill 0.38)
  Top 0.254: v58.37,46.1 59.35,46.1 D11.A
  Top 0.381: 49.66,30.99 39.5,30.99 | 39.5,30.99 29.59,30.99 | 59.69,30.48 57.15,30.48 56.64,30.99 55.63,30.99 | 19.05,31.11 9.78,31.11 9.02,30.35 R1.2 | 19.05,31.11 25.02,31.11 | 29.59,30.99 25.15,30.99 25.02,31.11 | D2.C | D2.C 19.05,31.11 | K1.5 20.7,16.89 20.7,28.83 20.32,29.21 D2.C | 59.69,30.48 D8.C 60.46,29.07 61.47,28.07 61.47,17.02 K3.5 | 39.5,30.99 D5.C 40.52,29.07 41.4,28.19 41.4,17.27 K2.5 | R7.2 49.66,30.99 | 59.69,30.48 69.85,30.48 | 69.85,30.48 79.63,30.48 80.01,30.1 D10.C 81.07,29.04 81.79,28.32 81.79,17.02 K4.5 | R9.2 69.85,30.48 | R16.2 24.98,31.15 25.02,31.11 | R3.2 29.59,28.98 29.59,30.99 | 55.63,30.99 49.66,30.99 | 55.63,30.99 D12.C v55.63,35.05
  Bottom 0.254: v58.37,46.1 54.48,46.1 52.96,44.58 52.96,39.37 52.96,36.96 54.86,35.05 v55.63,35.05
  Bottom 0.381: BYP.2 56.13,35.56 v55.63,35.05
5V_OUT
  Top 0.508: D12.A 55.63,37.55 R5.2
  Top 0.762: R5.2 55.75,37.68 52.43,37.68 C3.1
  pour Top (isolate 0.305, no thermals): 49.12,42.55 49.12,39.27 50.29,38.1 50.29,37.08 53.01,37.08 53.01,42.55
!RESET
  Top 0.254: R17.2 37.43,39.24 J9.5 33.02,38.61 31.5,38.61 30.23,37.34 30.23,36.44 31.11,35.55 U4.4
ADDR_JUMP  (via drill 0.38)
  Top 0.254: U4.6 33.66,34.54 34.42,33.78 34.69,33.78 36.32,33.78 36.83,34.29 v36.83,36.32
  Bottom 0.203: v36.83,36.32 36.96,36.45 39.37,36.45 39.78,36.85 ADR.1
CB
  Top 0.508: U1.1 55.6,41.79 C2.1
COM1
  Top 1.397: J5.2 16.64,8.89 13.59,11.94 8.89,11.94 8.38,11.94 5.97,14.35 5.97,22.48 K1.4
  Bottom 1.397: J5.2 13.64,11.94 8.38,11.94 5.97,14.35 5.97,22.48 K1.4
COM2
  Top 1.397: J6.2 30.27,11.68 28.45,11.68 26.29,13.84 26.29,22.48 K2.4
  Bottom 1.397: J6.2 30.27,11.68 28.45,11.68 26.29,13.84 26.29,22.48 K2.4 | J6.2
COM3
  Top 1.397: J7.2 49.45,8.97 46.61,11.81 46.61,22.48 K3.4
  Bottom 1.397: J7.2 49.45,8.97 46.61,11.81 46.61,22.48 K3.4
COM4
  Top 1.397: K4.4 66.93,22.48 66.93,9.99 J8.2
  Bottom 1.397: K4.4 66.93,22.48 66.93,9.99 J8.2
FB
  Top 0.254: U1.3 56.65,39.36 57.49,38.52 R5.1 57.53,37.68 R6.2
GND  (via drill 0.38)
  Top 0.508: U1.2 54.05,40.31 v53.92,40.18
  other vias: 30.35,33.91 39.24,34.04 37.97,41.4 50.8,34.29 45.21,38.28 31.62,43.69 29.77,39.34 26.16,40.77 32.51,36.83 34.54,28.19 14.1,28.19 54.61,28.07 75.06,27.94 53.92,39.17 58.8,34.19 55.6,45.26 78.99,34.16 3.68,37.21 53.85,34.29 58.93,36.83 56.97,40.31 56.97,41.45 56.97,42.47 53.92,41.33
  pour Bottom (rank 2): 0,25.91 82.55,25.91 82.55,46.99 0,46.99
  pour Top (rank 2): 0,25.91 0,46.99 82.55,46.99 82.55,25.91
MISO  (via drill 0.38)
  Top 0.254: U4.8 v34.92,42.29
  Bottom 0.254: v34.92,42.29 33.17,40.54 29.23,40.54 28.57,39.88 J9.1
N$1
  Top 0.254: R1.1 10.01,27.28 10.41,27.69 10.41,28.96 10.62,29.16 D1.A
N$2
  Top 0.254: R2.1 16.41,27.05 14.14,27.05 Q1.3 11.87,27.09 D1.C
N$3
  Top 0.254: U3.3 18.41,37.59 18.8,37.21 21.08,37.21 22.1,36.2 24.64,36.2 25.02,36.58 R15.1
N$4
  Top 0.254: R3.1 29.87,27.3 30.48,27.3 30.73,27.56 30.73,28.7 31.07,29.03 D4.A
N$5
  Top 0.254: R14.1 21.8,37.25 20.95,38.1 U3.1
N$6  (via drill 0.38)
  Top 0.254: U3.6 18.41,36.45 18.67,36.7 20.7,36.7 20.95,36.45 U3.8 20.95,34.42 21.72,33.66 v22.1,33.66 R16.1 | 44.07,36.37 46.35,36.37 46.61,36.12 U2.8 | U2.6 44.07,36.37 | 44.07,36.37 42.27,36.37 41.4,35.51 v41.4,33.71
  Bottom 0.254: v41.4,33.71 40.84,33.15 22.61,33.15 v22.1,33.66
N$7
  Top 0.254: D7.A 51,29.03 50.67,28.7 50.67,27.56 50.52,27.4 R7.1
N$8
  Top 0.254: 69.91,27.05 70.74,27.05 70.99,27.3 70.99,28.45 71.42,28.88 D9.A
  Top 0.305: R9.1 69.91,27.05
N$9
  Top 0.254: U2.1 46.61,37.64 45.85,36.88 42.04,36.88 41.1,35.94 40.26,35.94 39.12,37.08 R12.1
N$10
  Top 0.254: R2.2 17.38,28.98 17.78,28.57 | 17.78,28.57 | 17.78,28.57 17.78,27.43 18.31,26.9 D2.A K1.1
N$11
  Top 0.254: U2.3 44.07,38.28 43.22,37.43 40.69,37.43 R13.1
N$12
  Top 0.254: D4.C 32.44,27.09 Q2.3 37.16,27.09 R4.1
N$13
  Top 0.254: D11.C 61.62,44.7 61.49,44.58 60.22,44.58 60.01,44.36 R11.1
N$14  (via drill 0.38)
  Top 0.254: R11.2 v62.89,43.69
  Bottom 0.254: v62.89,43.69 62.89,44.2 62.38,44.7 LED.2
N$15
  Top 0.254: 52.38,26.97 Q3.3 57.22,26.97
  Top 0.305: D7.C 52.38,26.97 | 57.22,26.97 R8.1
N$17
  Top 0.254: 72.92,26.84 Q4.3 77.88,26.84
  Top 0.305: D9.C 72.92,26.84 | 77.88,26.84 R10.1
N$18
  Top 0.254: K2.1 39.37,26.64 D5.A 38.76,26.77 38.48,27.05 38.48,28.32 38.01,28.79 37.95,28.85 R4.2
N$23
  Top 0.254: R8.2 58.27,28.85 58.55,28.57 58.55,26.92 | 58.7,26.77 D8.A K3.1
  Top 0.305: 58.55,26.92 58.7,26.77
N$24
  Top 0.254: 78.04,28.57 78.87,28.57 79.25,28.19 79.25,26.92 | 79.43,26.74 D10.A K4.1
  Top 0.305: R10.2 78.04,28.57 | 79.25,26.92 79.43,26.74
NC1
  Top 1.397: K1.2 15.33,15.24 J5.3
  Bottom 1.397: K1.2 15.32,15.24 21.67,8.89 J5.3
NC2
  Top 1.397: K2.2 31.75,15.24 38.07,8.92 J6.3
  Bottom 1.397: K2.2 31.72,15.24 J6.3
NC3
  Top 1.397: J7.3 54.45,9.56 K3.2
  Bottom 1.397: 54.48,8.89 54.48,9.53 K3.2
NC4
  Top 1.397: J8.3 70.87,8.92 70.87,14.22 69.85,15.24 K4.2
  Bottom 1.397: J8.3 70.83,13.97 70.83,14.26 69.85,15.24 K4.2
NO1
  Top 1.397: K1.3 3.81,11.43 6.35,8.89 J5.1
  Bottom 1.397: J5.1 6.35,8.89 3.81,11.43 K1.3
NO2
  Top 1.397: J6.1 26.8,8.89 24.13,11.56 K2.3
  Bottom 1.397: J6.1 26.8,8.89 24.13,11.56 K2.3
NO3
  Top 1.397: J7.1 K3.3
  Bottom 1.397: J7.1 K3.3
NO4
  Top 1.397: J8.1 60.83,11.3 K4.3
  Bottom 1.397: J8.1 60.83,11.3 K4.3
OPTO_1  (via drill 0.38)
  Top 0.254: U3.5 17.14,34.16 v17.27,34.04 | Q1.1 14.16,30.08 v14.16,30.16
  Bottom 0.254: v17.27,34.04 18.03,34.04 19.05,33.02 19.05,31.75 18.41,31.11 14.61,31.11 14.16,30.67 v14.16,30.16
OPTO_2  (via drill 0.38)
  Top 0.254: v19.68,34.04 U3.7 | v34.54,30.1 34.59,30.1 Q2.1
  Bottom 0.254: v19.68,34.04 19.68,31.62 20.07,31.24 33.4,31.24 v34.54,30.1
OPTO_3  (via drill 0.38)
  Top 0.254: U2.5 42.8,34.47 43.1,34.16 45.29,34.16 v45.59,33.86
  Top 0.305: Q3.1 55.54,29.07 54.61,30 v54.48,30
  Bottom 0.254: v45.59,33.86 47.12,32.33 47.12,31.62 48.26,30.48 54,30.48 v54.48,30
OPTO_4  (via drill 0.38)
  Top 0.254: v47.5,33.91 46.53,33.91 45.34,35.1 U2.7 | v75.05,29.62 75.33,29.62 Q4.1
  Bottom 0.254: v47.5,33.91 47.75,33.66 47.75,32.26 49.02,30.99 73.68,30.99 v75.05,29.62
RELAY_CTRL1
  Top 0.254: R12.2 39.12,41.91 37.97,43.05 33.15,43.05 32.38,42.29 U4.10
RELAY_CTRL2
  Top 0.254: U4.11 | U4.11 31.11,41.91 32.77,43.56 36.07,43.56 | 36.07,43.56 38.61,43.56 40.64,41.53 R13.2 | 36.07,43.56
RELAY_CTRL3
  Top 0.254: R14.2 23.11,40.36 25.68,42.93 28.96,42.93 29.84,42.04 U4.12
RELAY_CTRL4
  Top 0.254: R15.2 25.02,41.53 25.91,42.42 27.94,42.42 28.57,41.78 U4.13
SCL/SCK  (via drill 0.38)
  Top 0.254: J2.4 75.16,37.19 v74.8,36.83 | v43.94,33.15 48.39,33.15 v48.77,33.53 | v20.57,33.15 v17.78,33.15 | J3.4 7.21,34.19 8.26,33.15 v9.4,33.15 | v33.66,42.29 U4.9 33.66,40.64 32.26,39.24 J9.3
  Bottom 0.254: v17.78,33.15 v9.4,33.15 | J1.1 35.56,44.58 33.66,42.67 v33.66,42.29 | J9.3 30.86,39.24 30.23,38.61 30.23,35.56 30.86,34.92 42.55,34.92 43.94,33.53 v43.94,33.15 43.94,32.89 43.69,32.64 21.34,32.64 20.83,33.15 v20.57,33.15 | v74.8,36.83 74.3,36.32 74.3,34.16 73.66,33.53 73.15,33.02 49.53,33.02 49.02,33.53 v48.77,33.53 | v20.57,33.15
SDA/MOSI  (via drill 0.38)
  Top 0.254: v20.57,32.13 v18.16,32.13 | J1.2 33.02,44.58 33.27,44.32 v36.83,44.32 | J9.4 32.51,38.1 34.92,38.1 | 34.92,38.1 v35.94,38.1 | J3.3 7.49,35.19 v7.75,34.92 | v75.18,35.69 75.68,36.19 J2.3 | v49.02,32.51 48.9,32.38 v45.62,32.38 | U4.7 34.92,38.1
  Bottom 0.254: v18.16,32.13 8.26,32.13 7.75,32.64 v7.75,34.92 | v35.94,38.1 35.94,36.2 36.7,35.43 43.03,35.43 45.11,33.35 | v35.94,38.1 | v35.94,38.1 35.94,42.8 36.83,43.69 v36.83,44.32 | v75.18,35.69 75.18,33.4 74.3,32.51 v49.02,32.51 | v20.57,32.13 43.89,32.13 45.11,33.35 | v45.62,32.38 45.62,32.84 45.11,33.35
SW
  pour Top (no thermals): 57.73,41.07 58.98,41.07 59.02,43.17 57.68,44.51 52.93,44.51 52.93,46.18 49.07,46.18 49.07,43.21 57.73,43.21
VIN
  Top 1.016: D3.A 68.41,34.14 J4.PWR
  Bottom 0.508: BYP.1 69.83,35.56 J4.PWR
VIN_DC_DC
  Top 1.016: D3.C 60.87,38.34 C1.A
  pour Top (no thermals): 62.23,39.88 62.23,37.9 59.79,37.9 59.79,39.37 59.13,40.04 57.73,40.06 57.73,40.54 61.57,40.54

### Text on the board
Bottom: v20
Dimension: Route Out | Route Out | Route Out | Route Out | Route Out | Route Out | Route Out | Route Out
tDocu: Elias Santistevan